# EAGLE design piezo-preamp-tickler_V3-single-supply-OPA1612 (EAGLE 8.3.2)

## Sheet 1 of 2
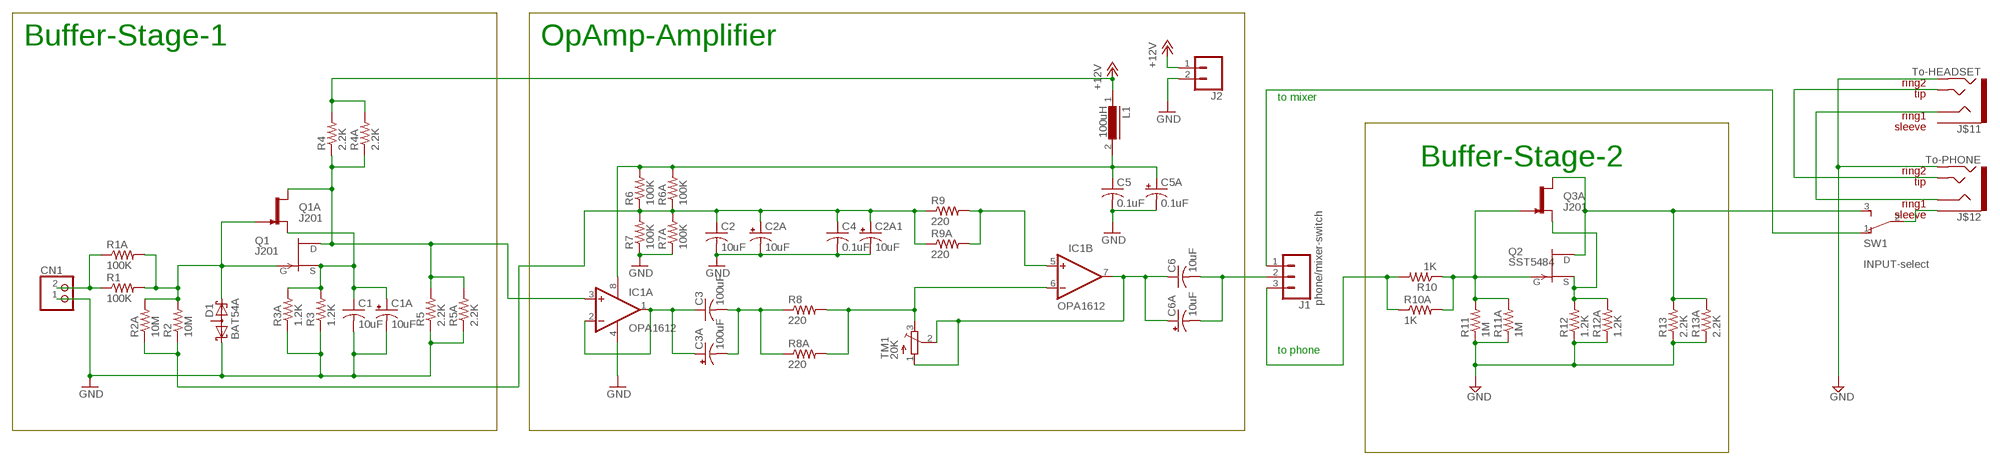
[diagram p0: schematic, sheet 1]

### Parts
C1  10uF  C-USC0805K  [C0805K]
C1A  10uF  CPOL-USE2,5-6E  [E2,5-6E]
C2  10uF  C-USC0805K  [C0805K]
C2A  10uF  CPOL-USE2,5-6E  [E2,5-6E]
C2A1  10uF  CPOL-USE2,5-6E  [E2,5-6E]
C3  100uF  C-USC0805K  [C0805K]
C3A  100uF  CPOL-USE2,5-6E  [E2,5-6E]
C4  0.1uF  C-USC0805K  [C0805K]
C5  0.1uF  C-USC0805K  [C0805K]
C5A  0.1uF  CPOL-USE2,5-6E  [E2,5-6E]
C6  10uF  C-USC0805K  [C0805K]
C6A  10uF  CPOL-USE2,5-6E  [E2,5-6E]
CN1  JST_2PIN-THM  [JST-PH-2-THM]
D1  BAT54A  [SOT23]
IC1  OPA1612  OPA2134UA  [SO08]
J1  phone/mixer-switch  CONN_03LOCK  [1X03_LOCK]
J2  CONN_02LOCK  [1X02_LOCK]
J$11  To-HEADSET  TRRS-3.5MMSJ-43512-SMT  [TRRS-SJ-43514-SMT-TR]
J$12  To-PHONE  TRRS-3.5MMSJ-43512-SMT  [TRRS-SJ-43514-SMT-TR]
L1  100uH  LBC-SE  [LBC-SE]
Q1  J201  SST5484  [SOT23]
Q1A  J201  [TO92-]
Q2  SST5484  [SOT23]
Q3A  J201  [TO92-]
R1  100K  R-US_R0603  [R0603]
R1A  100K  R-US_0204/2V  [0204V]
R2  10M  R-US_R0603  [R0603]
R2A  10M  R-US_0204/2V  [0204V]
R3  1.2K  R-US_R0603  [R0603]
R3A  1.2K  R-US_0204/2V  [0204V]
R4  2.2K  R-US_R0603  [R0603]
R4A  2.2K  R-US_0204/2V  [0204V]
R5  2.2K  R-US_R0603  [R0603]
R5A  2.2K  R-US_0204/2V  [0204V]
R6  100K  R-US_R0603  [R0603]
R6A  100K  R-US_0204/2V  [0204V]
R7  100K  R-US_R0603  [R0603]
R7A  100K  R-US_0204/2V  [0204V]
R8  220  R-US_R0603  [R0603]
R8A  220  R-US_R0603  [R0603]
R9  220  R-US_R0603  [R0603]
R9A  220  R-US_0204/2V  [0204V]
R10  1K  R-US_R0603  [R0603]
R10A  1K  R-US_0204/2V  [0204V]
R11  1M  R-US_R0603  [R0603]
R11A  1M  R-US_0204/2V  [0204V]
R12  1.2K  R-US_R0603  [R0603]
R12A  1.2K  R-US_0204/2V  [0204V]
R13  2.2K  R-US_R0603  [R0603]
R13A  2.2K  R-US_0204/2V  [0204V]
SW1  INPUT-select  SWITCH_SPDTTE-CONNECT  [SWITCH_SPDT-TE-CONNECT]
TM1  20K  TRIMPOTTC33X  [TC33X]

### Nets
+12V: J2.1 L1.1 R4.2 R4A.2
GND: C1.2 C1A.- C2.2 C2A1.- C2A.- C4.2 C5.2 C5A.- CN1.1 D1.1(K1) IC1.4(A:V-) J2.2 J$11.4(RING2) J$12.4(RING2) R3.1 R3A.1 R5.1 R5A.1 R7.1 R7A.1 R11.1 R11A.1 R12.1 R12A.1 R13.1 R13A.1 ; also sheet 2
N$1: C3.1 C3A.+ IC1.1(A:OUT) IC1.2(A:-IN)
N$3: J1.3 R10.2 R10A.1
N$16: IC1.5(B:+IN) R9.2 R9A.2
N$22: IC1.6(B:-IN) R8.2 R8A.2 TM1.3(E)
N$23: C6.2 C6A.- J1.2
N$24: CN1.2 R1.1 R1A.1
N$25: IC1.3(A:+IN) Q1.1(D) Q1A.3(D) R4.1 R4A.1 R5.2 R5A.2
N$30: Q2.2(S) Q3A.2(S) R12.2 R12A.2
N$31: C6.1 C6A.+ IC1.7(B:OUT) TM1.1(A) TM1.2(S)
N$32: C5.1 C5A.+ IC1.8(A:V+) L1.2 R6.2 R6A.2
N$33: C1.1 C1A.+ Q1.2(S) Q1A.2(S) R3.2 R3A.2
N$35: C2.1 C2A1.+ C2A.+ C4.1 R2.1 R2A.1 R6.1 R6A.1 R7.2 R7A.2 R9.1 R9A.1
N$36: D1.2(K2) Q1.3(G) Q1A.1(G) R1.2 R1A.2 R2.2 R2A.2
N$39: Q2.3(G) Q3A.1(G) R10.1 R10A.2 R11.2 R11A.2
N$42: J1.1 SW1.1
N$44: J$11.2(TIP) J$12.2(TIP)
N$45: J$11.3(RING1) J$12.3(RING1)
N$46: J$12.1(EARTH) SW1.2
N$52: C3.2 C3A.- R8.1 R8A.1
SELECT1: Q2.1(D) Q3A.3(D) R13.2 R13A.2 SW1.3
Unconnected: D1.3(AA) J$11.1(EARTH)

### Notes on the sheet
- Buffer-Stage-1 | OpAmp-Amplifier
- to mixer
- Buffer-Stage-2
- to phone

## Sheet 2 of 2
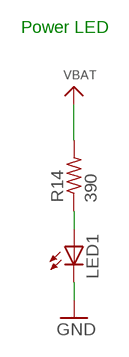
[diagram p1: schematic, sheet 2]

### Parts
LED1  LED3MM  [LED3MM]
R14  390  R-US_R0805  [R0805]

### Nets
GND: LED1.K(C) ; also sheet 1
N$18: LED1.A R14.1
VBAT: R14.2

### Notes on the sheet
- Power LED

## Library data of the parts
C1 C3-C6 = adafruit:C-US: CAPACITOR, American symbol
C1A C2A C2A1 C3A C5A C6A = rcl:CPOL-US: POLARIZED CAPACITOR, American symbol
C2 = rcl:C-US: CAPACITOR, American symbol
CN1 = adafruit:JST_2PIN: JST 2-Pin Connectors of various flavors SMT-RA (S2B-PH-SM4) 4UConnector #17311 SMT (B2B-PH-SM4) THM-RA (S2B-PH) THM (B2B-PH)
D1 = diode:BAT54A: Schottky Diodes Source: Fairchild .. BAT54.pdf
IC1 = linear:OPA2*: Dual Operational Amplifier Low Power, Single-Supply, Rail-To-Rail Operational Amplifier Source: http://focus.ti.com/lit/ds/symlink/opa2345.pdf http://focus.ti.com .. opa241.pdf http://focus.ti.com/lit/ds/symlink/opa2134.pdf
J1 = SparkFun-Connectors:CONN_03: Multi connection point. Often used as Generic Header-pin footprint for 0.1 inch spaced/style header connections On any of the 0.1 inch spaced packages, you can populate with these: Break Away Headers - Straight <https://www.sparkfun.com/products/116> (PRT-00116) Break Away Male Headers - Right Angle <https://www.sparkfun.com/products/553> (PRT-00553) Female Headers <https://www.sparkfun.com/products/115> (PRT-00115) Break Away Headers - Machine Pin <https://www.sparkfun.com/products/117> (PRT-00117) Break Away Female Headers - Swiss Machine Pin <https://www.sparkfun.com/products/743> (PRT-00743) Stackable Header - 3 Pin (Female, 0.1") <https://www.sparkfun.com/products/13875> (PRT-13875) For SCREWTERMINALS and SPRING TERMINALS visit here: Screw Terimnals on SparkFun.com <https://www.sparkfun.com/search/results?term=Screw+Terminals> (5mm/3.5mm/2.54mm spacing) This device is also useful as a general connection point to wire up your design to another part of your project. Our various solder wires solder well into these plated through hole pads. Hook-Up Wire - Assortment (Stranded, 22 AWG) <https://www.sparkfun.com/products/11375> (PRT-11375) Hook-Up Wire - Assortment (Solid Core, 22 AWG) <https://www.sparkfun.com/products/11367> (PRT-11367) View the entire wire category on our website here <https://www.sparkfun.com/categories/141> Special notes: Molex polarized connector foot print use with SKU : PRT-08232 with associated crimp pins and housings.
J2 = SparkFun-Connectors:CONN_02: Multi connection point. Often used as Generic Header-pin footprint for 0.1 inch spaced/style header connections On any of the 0.1 inch spaced packages, you can populate with these: Break Away Headers - Straight <https://www.sparkfun.com/products/116> (PRT-00116) Break Away Male Headers - Right Angle <https://www.sparkfun.com/products/553> (PRT-00553) Female Headers <https://www.sparkfun.com/products/115> (PRT-00115) Break Away Headers - Machine Pin <https://www.sparkfun.com/products/117> (PRT-00117) Break Away Female Headers - Swiss Machine Pin <https://www.sparkfun.com/products/743> (PRT-00743) For SCREWTERMINALS and SPRING TERMINALS visit here: Screw Terimnals on SparkFun.com <https://www.sparkfun.com/search/results?term=Screw+Terminals> (5mm/3.5mm/2.54mm spacing) This device is also useful as a general connection point to wire up your design to another part of your project. Our various solder wires solder well into these plated through hole pads. Hook-Up Wire - Assortment (Stranded, 22 AWG) <https://www.sparkfun.com/products/11375> (PRT-11375) Hook-Up Wire - Assortment (Solid Core, 22 AWG) <https://www.sparkfun.com/products/11367> (PRT-11367) View the entire wire category on our website here <https://www.sparkfun.com/categories/141> Special notes: Molex polarized connector foot print use with: PRT-08233 with associated crimp pins and housings. 2.54_SCREWTERM for use with PRT-10571. 3.5mm Screw Terminal footprints for PRT-08084 5mm Screw Terminal footprints for use with PRT-08432
J$11 J$12 = CMU-ArtFab:TRRS-3.5MM: Audio jack - 3.5mm TRRS variety - two rings.
L1 = inductors:LBC-SE: INDUCTOR
LED1 = led:LED: LED OSRAM: - CHIPLED LG R971, LG N971, LY N971, LG Q971, LY Q971, LO R971, LY R971 LH N974, LH R974 LS Q976, LO Q976, LY Q976 LO Q996 - Hyper CHIPLED LW Q18S LB Q993, LB Q99A, LB R99A - SideLED LS A670, LO A670, LY A670, LG A670, LP A670 LB A673, LV A673, LT A673, LW A673 LH A674 LY A675 LS A676, LA A676, LO A676, LY A676, LW A676 LS A679, LY A679, LG A679 - Hyper Micro SIDELED® LS Y876, LA Y876, LO Y876, LY Y876 LT Y87S - SmartLED LW L88C, LW L88S LB L89C, LB L89S, LG L890 LS L89K, LO L89K, LY L89K LS L896, LA L896, LO L896, LY L896 - TOPLED LS T670, LO T670, LY T670, LG T670, LP T670 LSG T670, LSP T670, LSY T670, LOP T670, LYG T670 LG T671, LOG T671, LSG T671 LB T673, LV T673, LT T673, LW T673 LH T674 LS T676, LA T676, LO T676, LY T676, LB T676, LH T676, LSB T676, LW T676 LB T67C, LV T67C, LT T67C, LS T67K, LO T67K, LY T67K, LW E67C LS E67B, LA E67B, LO E67B, LY E67B, LB E67C, LV E67C, LT E67C LW T67C LS T679, LY T679, LG T679 LS T770, LO T770, LY T770, LG T770, LP T770 LB T773, LV T773, LT T773, LW T773 LH T774 LS E675, LA E675, LY E675, LS T675 LS T776, LA T776, LO T776, LY T776, LB T776 LHGB T686 LT T68C, LB T68C - Hyper Mini TOPLED® LB M676 - Mini TOPLED Santana® LG M470 LS M47K, LO M47K, LY M47K Source: http://www.osram.convergy.de LUXEON: - LUMILED® LXK2-PW12-R00, LXK2-PW12-S00, LXK2-PW14-U00, LXK2-PW14-V00 LXK2-PM12-R00, LXK2-PM12-S00, LXK2-PM14-U00 LXK2-PE12-Q00, LXK2-PE12-R00, LXK2-PE12-S00, LXK2-PE14-T00, LXK2-PE14-U00 LXK2-PB12-K00, LXK2-PB12-L00, LXK2-PB12-M00, LXK2-PB14-N00, LXK2-PB14-P00, LXK2-PB14-Q00 LXK2-PR12-L00, LXK2-PR12-M00, LXK2-PR14-Q00, LXK2-PR14-R00 LXK2-PD12-Q00, LXK2-PD12-R00, LXK2-PD12-S00 LXK2-PH12-R00, LXK2-PH12-S00 LXK2-PL12-P00, LXK2-PL12-Q00, LXK2-PL12-R00 Source: www.luxeon.com KINGBRIGHT: KA-3528ASYC Source: www.kingbright.com
Q1 Q2 = transistor-fet:?548*: N-Channel JFETs Source: VISHAY 2N5484.pdf Compatible: TO92 2N5245 J304 J305 U310 J308 J309 J310 TO72 2N4416 2N4416A 2N3823 2N4351 3N169 3N170 3N171 MFE3002 TO18 2N3796 2N3797 MFE825 Source: Motorola European Master Guide Pacge 3-59
Q1A Q3A = CMU-ArtFab:J201: N-channel JFET
R1 R1A R2 R2A R3 R3A R4 R4A R5 R5A R6 R6A R7 R7A R8 R8A R9 R9A R10 R10A R11 R11A R12 R12A R13 R13A R14 = CMU-ArtFab:R-US_: RESISTOR, American symbol
SW1 = CMU-ArtFab:SWITCH_SPDT
TM1 = adafruit:TRIMPOT: SMT trimmer potentiometer part number TC33X http://www.ladyada.net/library/eagle

## Net classes
0 default: width 0.152 mm, clearance 0.2 mm

## Board
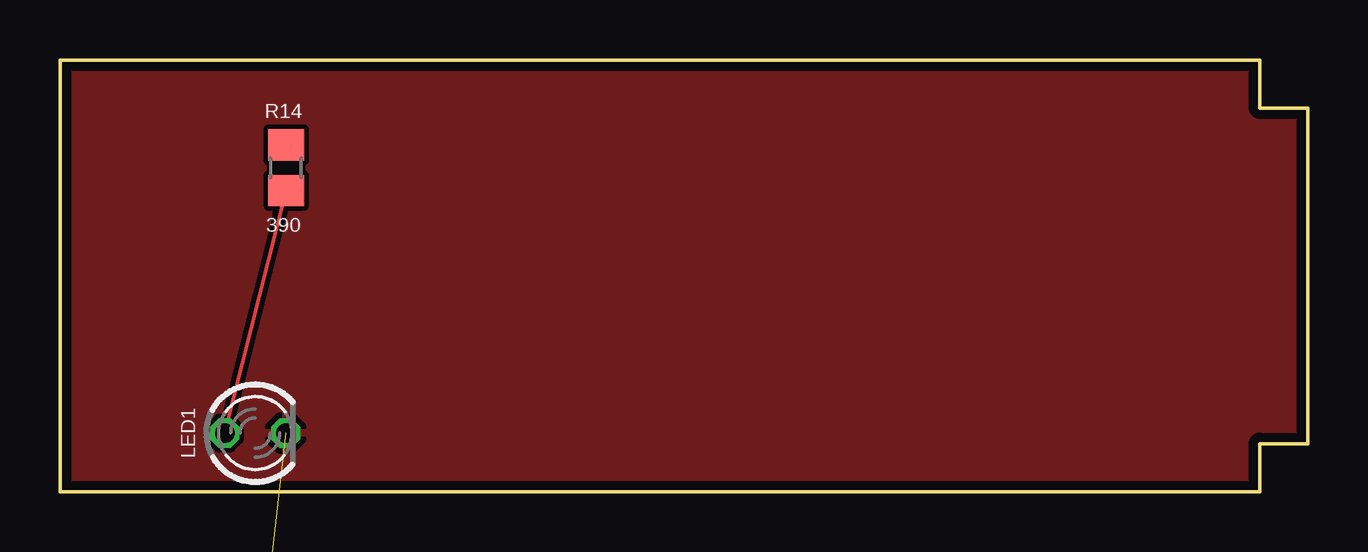
[diagram p2: board, top side]
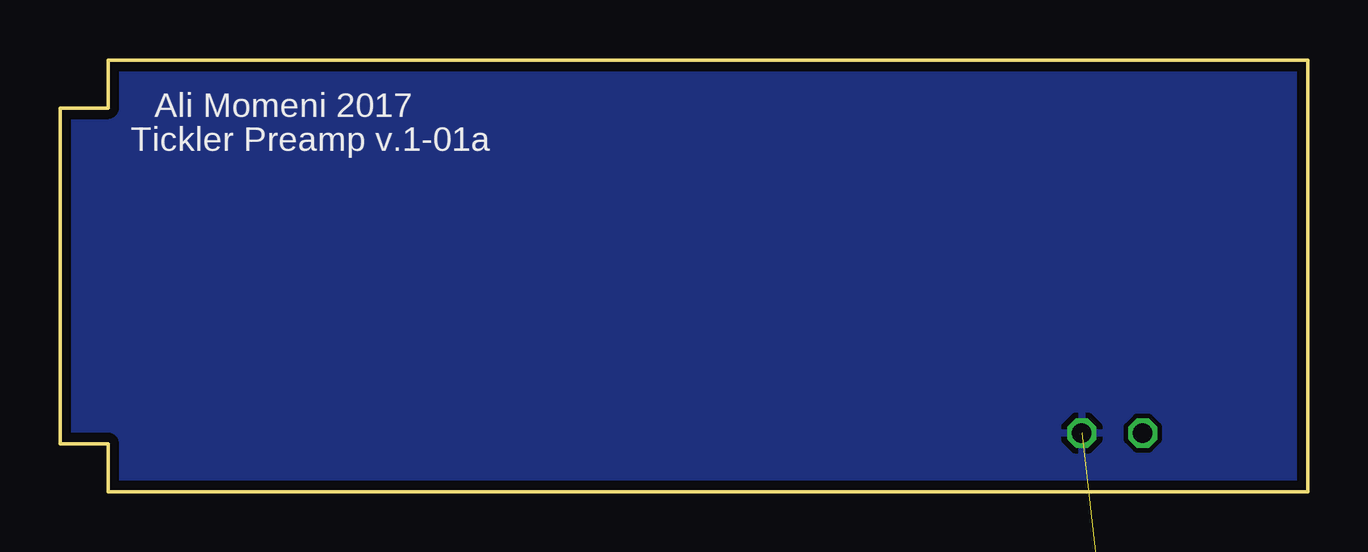
[diagram p3: board, bottom side, seen from below]

Size 52 x 18 mm. Coordinates in mm from the lower left corner, seen from the top.
Outline: 0,0 50,0 50,2 52,2 52,16 50,16 50,18 0,18 0,0
Copper layers (1*16): Top 0.0356mm / dielectric 1.5011mm / Bottom 0.0356mm
Design rules "oshpark-2layer": minimum track width 6mil, minimum drill 13mil, track to track 6mil, track to pad 6mil, pad to pad 6mil, via to via 6mil, smd to smd 6mil, copper to edge 15mil, drill to drill 6mil, minimum pad ring 7mil, minimum via ring 7mil, stop-mask expansion 2.5mil, vias tented up to drill 0mil, thermal gap 10mil

### Footprints (pad centres in the part's own frame; a part is rotated, then mirrored left to right if it is on the bottom)
C0805K = smd 1.1 x 1.4: 1 -1,0; 2 1,0
E2,5-6E = drill 0.813 pad 1.575: + -1.27,0 | drill 0.813 pad 1.575 octagon: - 1.27,0
C0805K' = smd 1.3 x 1.6: 1 -1,0; 2 1,0
JST-PH-2-THM = drill 0.8 pad 1.422: 1 1,0; 2 -1,0
SOT23 = smd 1 x 1.4: 1 -0.95,-1.1; 2 0.95,-1.1; 3 0,1.1
SO08 = smd 0.6 x 2.2: 1 -1.905,-2.6; 2 -0.635,-2.6; 3 0.635,-2.6; 4 1.905,-2.6; 5 1.905,2.6; 6 0.635,2.6; 7 -0.635,2.6; 8 -1.905,2.6
1X03_LOCK = drill 1.016 pad 1.88: 1 0,0.127; 2 2.54,-0.127; 3 5.08,0.127
1X02_LOCK = drill 1.016 pad 1.88: 1 -0.178,0; 2 2.718,0
TRRS-SJ-43514-SMT-TR = smd 0.635 x 1.27: 1 1.27,0; 2 6.35,0; 3 3.81,3.81; 4 2.54,0
LBC-SE = drill 0.914 octagon: 1 -2.54,0; 2 2.54,0
LED3MM = drill 0.813 octagon: A -1.27,0; K 1.27,0
TO92- = drill 0.7 octagon: 1 2.54,0; 2 0,0; 3 -2.54,0
R0603 = smd 1 x 1.1: 1 -0.85,0; 2 0.85,0
0204V = drill 0.813 pad 1.676 octagon: 1 -1.27,0; 2 1.27,0
R0805 = smd 1.3 x 1.5: 1 -0.95,0; 2 0.95,0
SWITCH_SPDT-TE-CONNECT = drill 0.8 pad 1.676: 1 2,0; 2 4,0; 3 6,0 | drill 1 pad 1.676: MOUNT1 0,0; MOUNT2 8,0
TC33X = smd 1.2 x 1.2: 1 -1,-1.825; 3 1,-1.825 | smd 1.5 x 1.6: 2 0,1.5

### Placement (x,y rotation side)
C1  -16,-307 0 top  (outside the outline)
C1A  -9,-540 0 top  (outside the outline)
C2  10uF  [C0805K']  -16,-594 0 top  (outside the outline)
C2A  -9,-605 0 top  (outside the outline)
C2A1  -9,-621 0 top  (outside the outline)
C3  -16,-312 0 top  (outside the outline)
C3A  -9,-660 0 top  (outside the outline)
C4  0,-191 0 top  (outside the outline)
C5  -6,-191 0 top  (outside the outline)
C5A  -9,-802 0 top  (outside the outline)
C6  6,-191 0 top  (outside the outline)
C6A  -9,-676 0 top  (outside the outline)
CN1  -10,-160 0 top  (outside the outline)
D1  -16,-552 0 top  (outside the outline)
IC1  -1.91,-411.63 0 top  (outside the outline)
J1  -9,-341 0 top  (outside the outline)
J2  -8,-694 0 top  (outside the outline)
J$11  -17,-425 0 top  (outside the outline)
J$12  -17,-436 0 top  (outside the outline)
L1  -9,-174 0 top  (outside the outline)
LED1  8.14,2.44 0 top
Q1  -0.95,-354.93 0 top  (outside the outline)
Q1A  -10,-788 0 top  (outside the outline)
Q2  -0.95,-369.83 0 top  (outside the outline)
Q3A  -10,-709 0 top  (outside the outline)
R1  4,-184 0 top  (outside the outline)
R1A  -1.27,-454.7 0 top  (outside the outline)
R2  10,-184 0 top  (outside the outline)
R2A  -8,-472 0 top  (outside the outline)
R3  -17,-209 0 top  (outside the outline)
R3A  -8,-506 0 top  (outside the outline)
R4  -17,-302 0 top  (outside the outline)
R4A  -8,-489 0 top  (outside the outline)
R5  -11,-209 0 top  (outside the outline)
R5A  -8,-523 0 top  (outside the outline)
R6  -8,-184 0 top  (outside the outline)
R6A  -8,-565 0 top  (outside the outline)
R7  -2,-184 0 top  (outside the outline)
R7A  -8,-582 0 top  (outside the outline)
R8  -12,-191 0 top  (outside the outline)
R8A  -17,-649 0 top  (outside the outline)
R9  -17,-191 0 top  (outside the outline)
R9A  -8,-638 0 top  (outside the outline)
R10  3,-273 0 top  (outside the outline)
R10A  -8,-723 0 top  (outside the outline)
R11  -2,-273 0 top  (outside the outline)
R11A  -8,-740 0 top  (outside the outline)
R12  18,-265 0 top  (outside the outline)
R12A  -8,-757 0 top  (outside the outline)
R13  24,-265 0 top  (outside the outline)
R13A  -8,-774 0 top  (outside the outline)
R14  9.42,13.5 90 top
SW1  -10,-239 0 top  (outside the outline)
TM1  -14,-186 0 top  (outside the outline)

### Tracks (layer width: path | path; a pad name or v marks a point on that pad's centre or on a via)
+12V  (3 unrouted)
GND  (26 unrouted)
  pour Top: -1,19.03 53,19.03 53,-0.97 -1,-0.97
  pour Bottom: -1,19.03 53,19.03 53,-0.97 -1,-0.97
N$1  (3 unrouted)
N$3  (2 unrouted)
N$16  (2 unrouted)
N$18
  Top 0.152: LED1.A R14.1
N$22  (3 unrouted)
N$23  (2 unrouted)
N$24  (2 unrouted)
N$25  (6 unrouted)
N$30  (3 unrouted)
N$31  (4 unrouted)
N$32  (5 unrouted)
N$33  (5 unrouted)
N$35  (11 unrouted)
N$36  (6 unrouted)
N$39  (5 unrouted)
N$42  (1 unrouted)
N$44  (1 unrouted)
N$45  (1 unrouted)
N$46  (1 unrouted)
N$52  (3 unrouted)
SELECT1  (4 unrouted)
VBAT
  Top 0.152: R14.2 arc-90 10.01,15.04

### Text on the board
bNames: Ali Momeni 2017 | Tickler Preamp v.1-01a